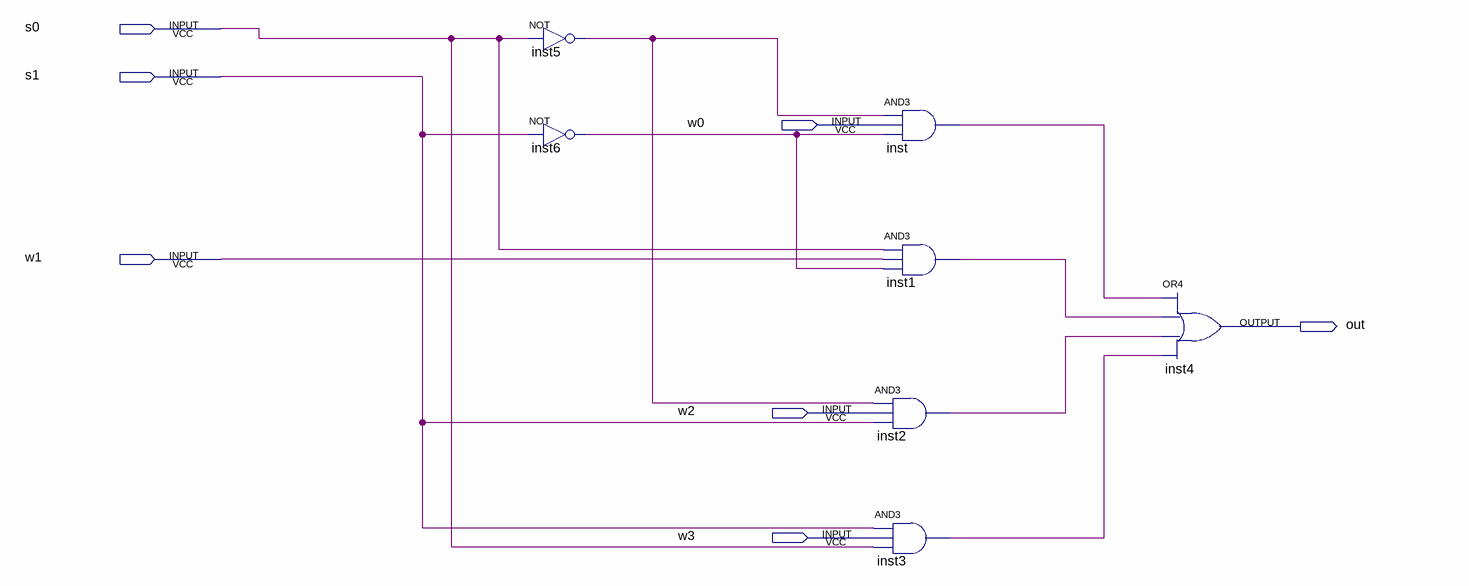
[diagram p0: schematic sheet]
// Quartus schematic 4_to_1_mux.bdf as structural Verilog: 7 symbols, 7 pins
module \4_to_1_mux  (
  input  s0,
  input  s1,
  input  w0,
  input  w1,
  input  w2,
  input  w3,
  output out
);

  wire inst1_out, inst2_out, inst3_out, inst5_out, inst6_out, inst_out;

  not inst5 (inst5_out, s0);
  not inst6 (inst6_out, s1);
  and inst (inst_out, inst5_out, w0, inst6_out);
  and inst1 (inst1_out, s0, w1, inst6_out);
  and inst2 (inst2_out, inst5_out, w2, s1);
  and inst3 (inst3_out, s1, w3, s0);
  or inst4 (out, inst_out, inst1_out, inst2_out, inst3_out);
endmodule
